# Altium project STM32H7_Core.PrjPcb
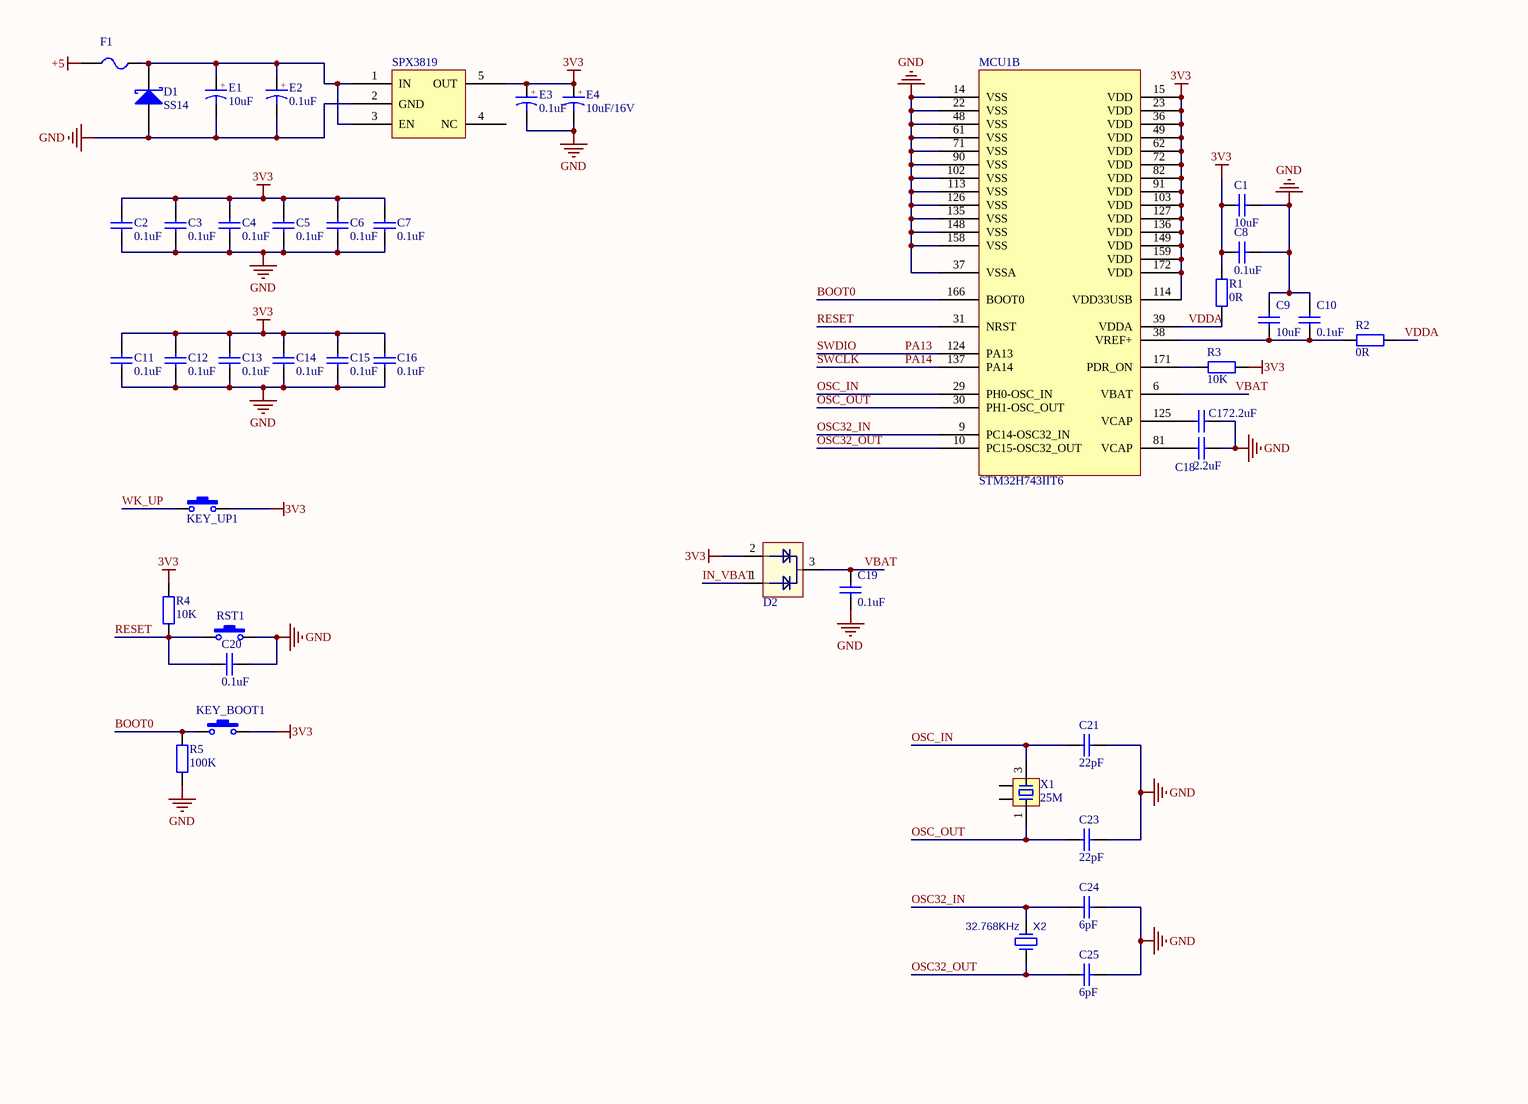
[diagram p0: STM32H7_Core.SchDoc, top left]
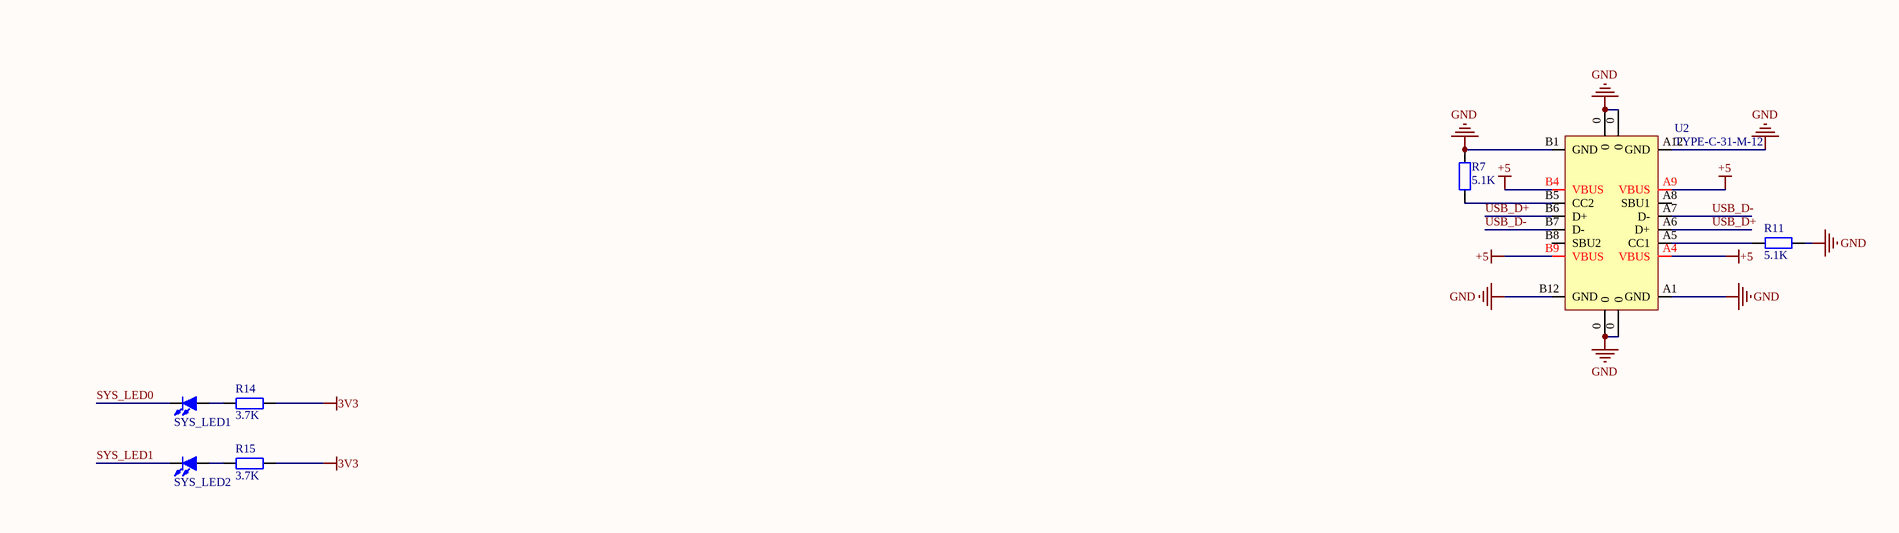
[diagram p1: STM32H7_Core.SchDoc, top right]
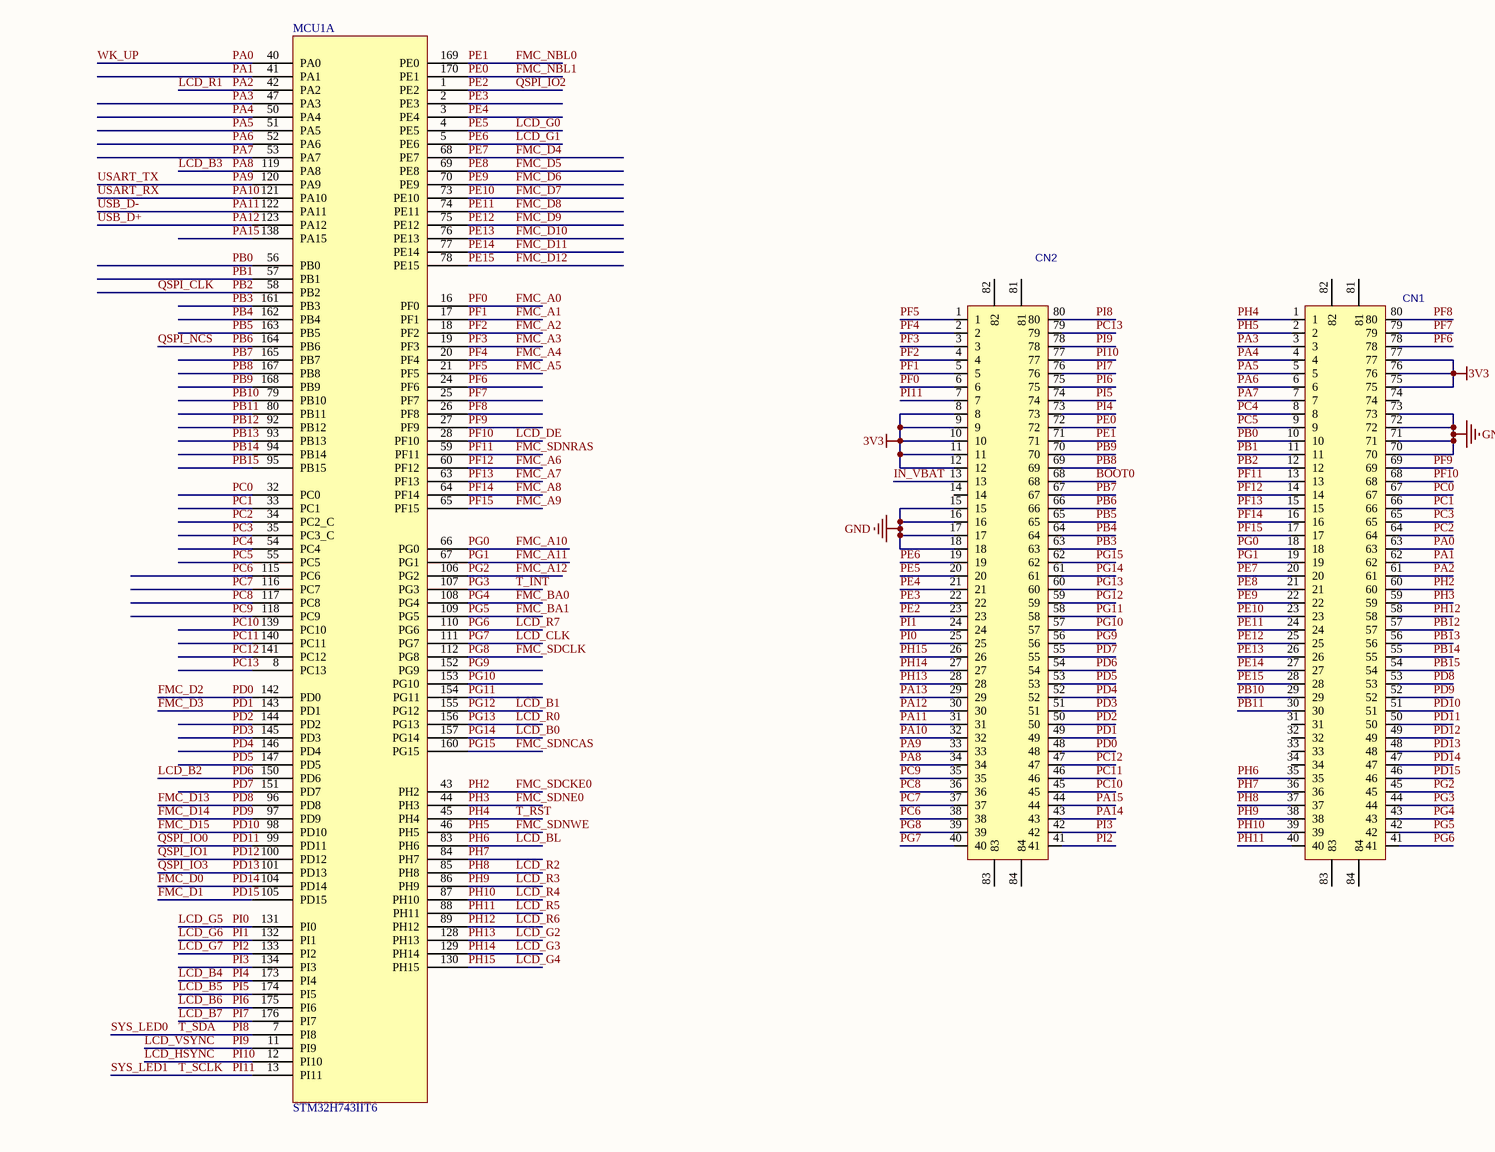
[diagram p2: STM32H7_Core.SchDoc, bottom left]
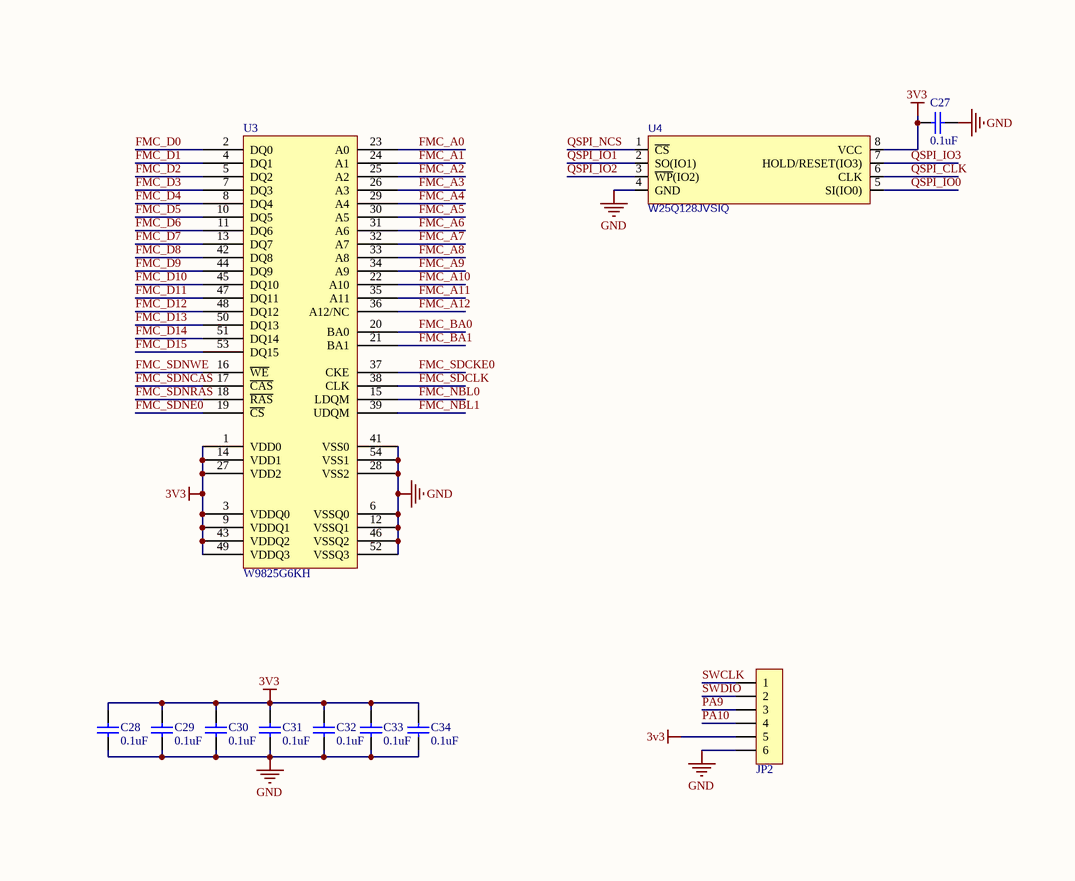
[diagram p3: STM32H7_Core.SchDoc, bottom right]
1 sheet, 63 parts. Net scope: global (net labels, ports and power ports of the same name join across sheets).
Board file: STM32H7_Core.PcbDoc

## Sheet STM32H7_Core.SchDoc
size A1

### Parts
C1  10uF  [C0603_L]
C2  0.1uF  [C0603_L]
C3  0.1uF  [C0603_L]
C4  0.1uF  [C0603_L]
C5  0.1uF  [C0603_L]
C6  0.1uF  [C0603_L]
C7  0.1uF  [C0603_L]
C8  0.1uF  [C0603_L]
C9  10uF  [C0603_L]
C10  0.1uF  [C0603_L]
C11  0.1uF  [C0603_L]
C12  0.1uF  [C0603_L]
C13  0.1uF  [C0603_L]
C14  0.1uF  [C0603_L]
C15  0.1uF  [C0603_L]
C16  0.1uF  [C0603_L]
C17  2.2uF  [C0603_L]
C18  2.2uF  [C0603_L]
C19  0.1uF  [C0603_L]
C20  0.1uF  [C0603_L]
C21  22pF  [C0603_L]
C23  22pF  [C0603_L]
C24  6pF  [C0603_L]
C25  6pF  [C0603_L]
C27  0.1uF  [C0603_L]
C28  0.1uF  [C0603_L]
C29  0.1uF  [C0603_L]
C30  0.1uF  [C0603_L]
C31  0.1uF  [C0603_L]
C32  0.1uF  [C0603_L]
C33  0.1uF  [C0603_L]
C34  0.1uF  [C0603_L]
CN1  DF40C-80DP-0.4V(51)  [DF40C-80DP-0.4V]  (value not drawn)
CN2  DF40C-80DP-0.4V(51)  [DF40C-80DP-0.4V]  (value not drawn)
D1  SS14  [SMA]
D2  BAT54C  [SOT23-3L]  (value not drawn)
E1  10uF  [C_3216]
E2  0.1uF  [C_3216]
E3  0.1uF  [C_3216]
E4  10uF/16V  [C_3216]
F1  MSMD200-8V 1A  [FU 0603]  (value not drawn)
JP2  HDR-1X6  [PH2.0-WS-6P]  (value not drawn)
KEY_BOOT1  3x6x5  [SW 3*6*4.3-S-W]  (value not drawn)
KEY_UP1  3x6x5  [SW 3*6*4.3-S-W]  (value not drawn)
MCU1  STM32H743IIT6  [LQFT-176]  (parts A,B of 2)
R1  0R  [R0603_L]
R2  0R  [R0603_L]
R3  10K  [R0603_L]
R4  10K  [R0603_L]
R5  100K  [R0603_L]
R7  5.1K  [R0603_L]
R11  5.1K  [R0603_L]
R14  3.7K  [R0603_L]
R15  3.7K  [R0603_L]
RST1  3x6x5  [SW 3*6*4.3-S-W]  (value not drawn)
SYS_LED1  红色  [LED0603_G]  (value not drawn)
SYS_LED2  红色  [LED0603_G]  (value not drawn)
U1  SPX3819  [SOT23-5L]
U2  TYPE-C-31-M-12  [TYPE-C-31-M-12]
U3  W9825G6KH  [TSOP-54]
U4  W25Q128JVSIQ  [SOIC-8]
X1  25M  [OSC 3225-4P]
X2  32.768KHz  [SMD3215-2P]

### Nets
3V3: C1.2 C2.2 C3.2 C4.2 C5.2 C6.2 C7.2 C8.2 C11.2 C12.2 C13.2 C14.2 C15.2 C16.2 C27.1 C28.2 C29.2 C30.2 C31.2 C32.2 C33.2 C34.2 CN1.75 CN1.76 CN1.77 CN2.8 CN2.9 CN2.10 CN2.11 CN2.12 D2.2 E3.1(A) E4.1(A) JP2.5 KEY_BOOT1.2 KEY_UP1.2 MCU1.15(VDD) MCU1.23(VDD) MCU1.36(VDD) MCU1.49(VDD) MCU1.62(VDD) MCU1.72(VDD) MCU1.82(VDD) MCU1.91(VDD) MCU1.103(VDD) MCU1.114(VDD33USB) MCU1.127(VDD) MCU1.136(VDD) MCU1.149(VDD) MCU1.159(VDD) MCU1.172(VDD) R1.2 R3.2 R4.1 R14.2 R15.2 U1.5(OUT) U3.1(VDD0) U3.3(VDDQ0) U3.9(VDDQ1) U3.14(VDD1) U3.27(VDD2) U3.43(VDDQ2) U3.49(VDDQ3) U4.8(VCC)
+5: F1.1 U2.A4(VBUS) U2.A9(VBUS) U2.B4(VBUS) U2.B9(VBUS)
GND: C1.1 C2.1 C3.1 C4.1 C5.1 C6.1 C7.1 C8.1 C9.2 C10.2 C11.1 C12.1 C13.1 C14.1 C15.1 C16.1 C17.1 C18.1 C19.1 C20.1 C21.1 C23.1 C24.1 C25.1 C27.2 C28.1 C29.1 C30.1 C31.1 C32.1 C33.1 C34.1 CN1.70 CN1.71 CN1.72 CN1.73 CN2.15 CN2.16 CN2.17 CN2.18 D1.1(A) E1.2(K) E2.2(K) E3.2(K) E4.2(K) JP2.6 MCU1.14(VSS) MCU1.22(VSS) MCU1.37(VSSA) MCU1.48(VSS) MCU1.61(VSS) MCU1.71(VSS) MCU1.90(VSS) MCU1.102(VSS) MCU1.113(VSS) MCU1.126(VSS) MCU1.135(VSS) MCU1.148(VSS) MCU1.158(VSS) R5.2 R7.2 R11.1 RST1.2 U1.2(GND) U2.0 U2.A1(GND) U2.A12(GND) U2.B1(GND) U2.B12(GND) U3.6(VSSQ0) U3.12(VSSQ1) U3.28(VSS2) U3.41(VSS0) U3.46(VSSQ2) U3.52(VSSQ3) U3.54(VSS1) U4.4(GND)
BOOT0: CN2.68 KEY_BOOT1.1 MCU1.166(BOOT0) R5.1
FMC_A0: CN2.6 MCU1.16(PF0) U3.23(A0)  [also labelled PF0]
FMC_A1: CN2.5 MCU1.17(PF1) U3.24(A1)  [also labelled PF1]
FMC_A2: CN2.4 MCU1.18(PF2) U3.25(A2)  [also labelled PF2]
FMC_A3: CN2.3 MCU1.19(PF3) U3.26(A3)  [also labelled PF3]
FMC_A4: CN2.2 MCU1.20(PF4) U3.29(A4)  [also labelled PF4]
FMC_A5: CN2.1 MCU1.21(PF5) U3.30(A5)  [also labelled PF5]
FMC_A6: CN1.14 MCU1.60(PF12) U3.31(A6)  [also labelled PF12]
FMC_A7: CN1.15 MCU1.63(PF13) U3.32(A7)  [also labelled PF13]
FMC_A8: CN1.16 MCU1.64(PF14) U3.33(A8)  [also labelled PF14]
FMC_A9: CN1.17 MCU1.65(PF15) U3.34(A9)  [also labelled PF15]
FMC_A10: CN1.18 MCU1.66(PG0) U3.22(A10)  [also labelled PG0]
FMC_A11: CN1.19 MCU1.67(PG1) U3.35(A11)  [also labelled PG1]
FMC_A12: CN1.45 MCU1.106(PG2) U3.36(A12/NC)  [also labelled PG2]
FMC_BA0: CN1.43 MCU1.108(PG4) U3.20(BA0)  [also labelled PG4]
FMC_BA1: CN1.42 MCU1.109(PG5) U3.21(BA1)  [also labelled PG5]
FMC_D0: CN1.47 MCU1.104(PD14) U3.2(DQ0)  [also labelled PD14]
FMC_D1: CN1.46 MCU1.105(PD15) U3.4(DQ1)  [also labelled PD15]
FMC_D2: CN2.48 MCU1.142(PD0) U3.5(DQ2)  [also labelled PD0]
FMC_D3: CN2.49 MCU1.143(PD1) U3.7(DQ3)  [also labelled PD1]
FMC_D4: CN1.20 MCU1.68(PE7) U3.8(DQ4)  [also labelled PE7]
FMC_D5: CN1.21 MCU1.69(PE8) U3.10(DQ5)  [also labelled PE8]
FMC_D6: CN1.22 MCU1.70(PE9) U3.11(DQ6)  [also labelled PE9]
FMC_D7: CN1.23 MCU1.73(PE10) U3.13(DQ7)  [also labelled PE10]
FMC_D8: CN1.24 MCU1.74(PE11) U3.42(DQ8)  [also labelled PE11]
FMC_D9: CN1.25 MCU1.75(PE12) U3.44(DQ9)  [also labelled PE12]
FMC_D10: CN1.26 MCU1.76(PE13) U3.45(DQ10)  [also labelled PE13]
FMC_D11: CN1.27 MCU1.77(PE14) U3.47(DQ11)  [also labelled PE14]
FMC_D12: CN1.28 MCU1.78(PE15) U3.48(DQ12)  [also labelled PE15]
FMC_D13: CN1.53 MCU1.96(PD8) U3.50(DQ13)  [also labelled PD8]
FMC_D14: CN1.52 MCU1.97(PD9) U3.51(DQ14)  [also labelled PD9]
FMC_D15: CN1.51 MCU1.98(PD10) U3.53(DQ15)  [also labelled PD10]
FMC_NBL0: CN2.71 MCU1.169(PE0) U3.15(LDQM)  [also labelled PE1]
FMC_NBL1: CN2.72 MCU1.170(PE1) U3.39(UDQM)  [also labelled PE0]
FMC_SDCKE0: CN1.60 MCU1.43(PH2) U3.37(CKE)  [also labelled PH2]
FMC_SDCLK: CN2.39 MCU1.112(PG8) U3.38(CLK)  [also labelled PG8]
FMC_SDNCAS: CN2.62 MCU1.160(PG15) U3.17(~{CAS})  [also labelled PG15]
FMC_SDNE0: CN1.59 MCU1.44(PH3) U3.19(~{CS})  [also labelled PH3]
FMC_SDNRAS: CN1.13 MCU1.59(PF11) U3.18(~{RAS})  [also labelled PF11]
FMC_SDNWE: CN1.2 MCU1.46(PH5) U3.16(~{WE})  [also labelled PH5]
IN_VBAT: CN2.13 D2.1
LCD_B0: CN2.61 MCU1.157(PG14)  [also labelled PG14]
LCD_B1: CN2.59 MCU1.155(PG12)  [also labelled PG12]
LCD_B2: CN2.54 MCU1.150(PD6)  [also labelled PD6]
LCD_B3: CN2.34 MCU1.119(PA8)  [also labelled PA8]
LCD_B4: CN2.73 MCU1.173(PI4)  [also labelled PI4]
LCD_B5: CN2.74 MCU1.174(PI5)  [also labelled PI5]
LCD_B6: CN2.75 MCU1.175(PI6)  [also labelled PI6]
LCD_B7: CN2.76 MCU1.176(PI7)  [also labelled PI7]
LCD_BL: CN1.35 MCU1.83(PH6)  [also labelled PH6]
LCD_CLK: CN2.40 MCU1.111(PG7)  [also labelled PG7]
LCD_DE: CN1.68 MCU1.28(PF10)  [also labelled PF10]
LCD_G0: CN2.20 MCU1.4(PE5)  [also labelled PE5]
LCD_G1: CN2.19 MCU1.5(PE6)  [also labelled PE6]
LCD_G2: CN2.28 MCU1.128(PH13)  [also labelled PH13]
LCD_G3: CN2.27 MCU1.129(PH14)  [also labelled PH14]
LCD_G4: CN2.26 MCU1.130(PH15)  [also labelled PH15]
LCD_G5: CN2.25 MCU1.131(PI0)  [also labelled PI0]
LCD_G6: CN2.24 MCU1.132(PI1)  [also labelled PI1]
LCD_G7: CN2.41 MCU1.133(PI2)  [also labelled PI2]
LCD_HSYNC: CN2.77 MCU1.12(PI10)  [also labelled PI10]
LCD_R0: CN2.60 MCU1.156(PG13)  [also labelled PG13]
LCD_R1: CN1.61 MCU1.42(PA2)  [also labelled PA2]
LCD_R2: CN1.37 MCU1.85(PH8)  [also labelled PH8]
LCD_R3: CN1.38 MCU1.86(PH9)  [also labelled PH9]
LCD_R4: CN1.39 MCU1.87(PH10)  [also labelled PH10]
LCD_R5: CN1.40 MCU1.88(PH11)  [also labelled PH11]
LCD_R6: CN1.58 MCU1.89(PH12)  [also labelled PH12]
LCD_R7: CN1.41 MCU1.110(PG6)  [also labelled PG6]
LCD_VSYNC: CN2.78 MCU1.11(PI9)  [also labelled PI9]
OSC32_IN: C24.2 MCU1.9(PC14-OSC32_IN) X2.2
OSC32_OUT: C25.2 MCU1.10(PC15-OSC32_OUT) X2.1
OSC_IN: C21.2 MCU1.29(PH0-OSC_IN) X1.3
OSC_OUT: C23.2 MCU1.30(PH1-OSC_OUT) X1.1
PA0: CN1.63 KEY_UP1.1 MCU1.40(PA0)  [also labelled WK_UP]
PA1: CN1.62 MCU1.41(PA1)
PA3: CN1.3 MCU1.47(PA3)
PA4: CN1.4 MCU1.50(PA4)
PA5: CN1.5 MCU1.51(PA5)
PA6: CN1.6 MCU1.52(PA6)
PA7: CN1.7 MCU1.53(PA7)
PA9: CN2.33 JP2.3 MCU1.120(PA9)  [also labelled USART_TX]
PA10: CN2.32 JP2.4 MCU1.121(PA10)  [also labelled USART_RX]
PA11: CN2.31 MCU1.122(PA11) U2.A7(D-) U2.B7(D-)  [also labelled USB_D-]
PA12: CN2.30 MCU1.123(PA12) U2.A6(D+) U2.B6(D+)  [also labelled USB_D+]
PA13: CN2.29 JP2.2 MCU1.124(PA13)  [also labelled SWDIO]
PA14: CN2.43 JP2.1 MCU1.137(PA14)  [also labelled SWCLK]
PA15: CN2.44 MCU1.138(PA15)
PB0: CN1.10 MCU1.56(PB0)
PB1: CN1.11 MCU1.57(PB1)
PB2: CN1.12 MCU1.58(PB2) U4.6(CLK)  [also labelled QSPI_CLK]
PB3: CN2.63 MCU1.161(PB3)
PB4: CN2.64 MCU1.162(PB4)
PB5: CN2.65 MCU1.163(PB5)
PB6: CN2.66 MCU1.164(PB6) U4.1(~{CS})  [also labelled QSPI_NCS]
PB7: CN2.67 MCU1.165(PB7)
PB8: CN2.69 MCU1.167(PB8)
PB9: CN2.70 MCU1.168(PB9)
PB10: CN1.29 MCU1.79(PB10)
PB11: CN1.30 MCU1.80(PB11)
PB12: CN1.57 MCU1.92(PB12)
PB13: CN1.56 MCU1.93(PB13)
PB14: CN1.55 MCU1.94(PB14)
PB15: CN1.54 MCU1.95(PB15)
PC0: CN1.67 MCU1.32(PC0)
PC1: CN1.66 MCU1.33(PC1)
PC2: CN1.64 MCU1.34(PC2_C)
PC3: CN1.65 MCU1.35(PC3_C)
PC4: CN1.8 MCU1.54(PC4)
PC5: CN1.9 MCU1.55(PC5)
PC6: CN2.38 MCU1.115(PC6)
PC7: CN2.37 MCU1.116(PC7)
PC8: CN2.36 MCU1.117(PC8)
PC9: CN2.35 MCU1.118(PC9)
PC10: CN2.45 MCU1.139(PC10)
PC11: CN2.46 MCU1.140(PC11)
PC12: CN2.47 MCU1.141(PC12)
PC13: CN2.79 MCU1.8(PC13)
PD2: CN2.50 MCU1.144(PD2)
PD3: CN2.51 MCU1.145(PD3)
PD4: CN2.52 MCU1.146(PD4)
PD5: CN2.53 MCU1.147(PD5)
PD7: CN2.55 MCU1.151(PD7)
PD11: CN1.50 MCU1.99(PD11) U4.5(SI(IO0))  [also labelled QSPI_IO0]
PD12: CN1.49 MCU1.100(PD12) U4.2(SO(IO1))  [also labelled QSPI_IO1]
PD13: CN1.48 MCU1.101(PD13) U4.7(HOLD/RESET(IO3))  [also labelled QSPI_IO3]
PE2: CN2.23 MCU1.1(PE2) U4.3(~{WP}(IO2))  [also labelled QSPI_IO2]
PE3: CN2.22 MCU1.2(PE3)
PE4: CN2.21 MCU1.3(PE4)
PF6: CN1.78 MCU1.24(PF6)
PF7: CN1.79 MCU1.25(PF7)
PF8: CN1.80 MCU1.26(PF8)
PF9: CN1.69 MCU1.27(PF9)
PG3: CN1.44 MCU1.107(PG3)  [also labelled T_INT]
PG9: CN2.56 MCU1.152(PG9)
PG10: CN2.57 MCU1.153(PG10)
PG11: CN2.58 MCU1.154(PG11)
PH4: CN1.1 MCU1.45(PH4)  [also labelled T_RST]
PH7: CN1.36 MCU1.84(PH7)
PI3: CN2.42 MCU1.134(PI3)
PI8: CN2.80 MCU1.7(PI8) SYS_LED1.2(K)  [also labelled SYS_LED0, T_SDA]
PI11: CN2.7 MCU1.13(PI11) SYS_LED2.2(K)  [also labelled SYS_LED1, T_SCLK]
RESET: C20.2 MCU1.31(NRST) R4.2 RST1.1
VBAT: C19.2 D2.3 MCU1.6(VBAT)
VDDA: MCU1.39(VDDA) R1.1 R2.1
NetC9_1: C9.1 C10.1 MCU1.38(VREF+) R2.2
NetC17_2: C17.2 MCU1.125(VCAP)
NetC18_2: C18.2 MCU1.81(VCAP)
NetD1_2: D1.2(K) E1.1(A) E2.1(A) F1.2 U1.1(IN) U1.3(EN)
NetMCU1_171: MCU1.171(PDR_ON) R3.1
NetR7_1: R7.1 U2.B5(CC2)
NetR11_2: R11.2 U2.A5(CC1)
NetR14_1: R14.1 SYS_LED1.1(A)
NetR15_1: R15.1 SYS_LED2.1(A)

Not connected (* = marked no-connect by the designer): CN1 31 32 33 34 74 81 82 83 84; CN2 14 81 82 83 84; U1 4(NC); U2 A8(SBU1) B8(SBU2); X1 2 4

### Notes on the sheet
- (in symbol CT) +

### Library data of the parts
C1-C21 C23-C25 C27-C34 = C: 贴片电容; BOM名称: 无极性贴片电容; 联系卖家，免费查找封装: 唯一出售店铺网址https://shop463601444.taobao.com; 封装库来自淘宝卖家ID：黄晶宝石: 其他店铺购入均为盗版假冒封装库，请立即申请退款
CN1 CN2 = DF40C-80DP-0.4V(51): BOM_Manufacturer: HRS(Hirose); Contributor: LCSC; BOM_Supplier: LCSC; BOM_Supplier Part: C294544; BOM_Manufacturer Part: DF40C-80DP-0.4V(51); BOM_JLCPCB Part Class: Extended Part; spicePre: C; spiceSymbolName: DF40C-80DP-0.4V(51)
D1 = SS14: 肖特基二极管; 属性: 40V/1A; 联系卖家，免费查找封装: 唯一出售店铺网址https://shop463601444.taobao.com; BOM名称: 肖特基二极管
D2 = BAT54C: 两路肖特基二极管
E1-E4 = CT: 贴片钽电容; 联系卖家，免费查找封装: 唯一出售店铺网址https://shop463601444.taobao.com; 封装库来自淘宝卖家ID：黄晶宝石: 其他店铺购入均为盗版假冒封装库，请立即申请退款; BOM名称: 贴片钽电容
F1 = FU: 贴片保险丝; 联系卖家，免费查找封装: 唯一出售店铺网址https://shop463601444.taobao.com; BOM名称: 贴片保险丝
JP2 = Header 6: 6P接插件; 封装库来自淘宝卖家 ID：黄晶宝石: https://shop463601444.taobao.com
KEY_BOOT1 KEY_UP1 RST1 = SW-PB: 微动开关; BOM名称: 3x6轻触开关; 联系卖家，免费查找封装: 唯一出售店铺网址https://shop463601444.taobao.com
R1-R5 R7 R11 R14 R15 = R: 贴片电阻; 联系卖家，免费查找封装: 唯一出售店铺网址https://shop463601444.taobao.com; 封装库来自淘宝卖家ID：黄晶宝石: 其他店铺购入均为盗版假冒封装库，请立即申请退款; BOM名称: 贴片电阻
SYS_LED1 SYS_LED2 = LED-SMD: 贴片LED; 封装库来自淘宝卖家 ID：黄晶宝石: 其他店铺购入均为假冒，请立即申请退款，本店奖励现金5~20元; BOM名称: 贴片LED
U2 = TYPE-C-31-M-12: C165948
U3 = W9825G6KH: C97572
U4 = W25Q128: SPI FLASH; 封装库来自 淘宝卖家 ID：黄晶宝石: 其他店铺购入均为盗版假冒封装库，请立即申请退款
X1 = XTAL-4P: 4脚无源晶振; 联系卖家，免费查找封装: 唯一出售店铺网址https://shop463601444.taobao.com; BOM名称: 4脚无源晶振
X2 = 32.768KHz: 立创商城:C48615; BOM_Manufacturer Part: Q13FC1350000200; BOM_Manufacturer: EPSON; nameAlias: Frequency; BOM_Supplier: LCSC; BOM_Supplier Part: C48615; BOM_JLCPCB Part Class: Extended Part; spicePre: X; spiceSymbolName: Q13FC1350000200